# EAGLE design HomeAutomation_relay (EAGLE 8.2.2)
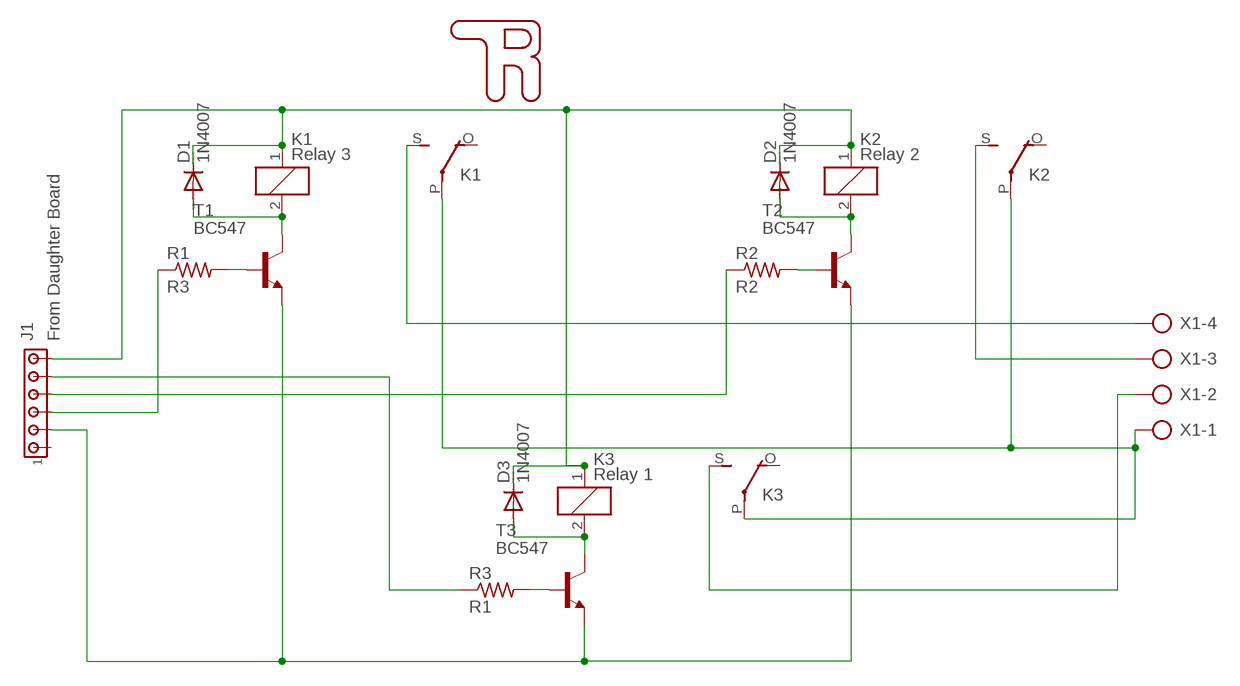
[diagram p0: schematic, sheet 1]

## Parts
D1  1N4007  1N4004  [DO41-10]
D2  1N4007  1N4004  [DO41-10]
D3  1N4007  1N4004  [DO41-10]
J1  From Daughter Board  MTA06-100  [10X06MTA]
K1  Relay 3  G5LE  [G5LE]
K2  Relay 2  G5LE  [G5LE]
K3  Relay 1  G5LE  [G5LE]
R1  R3  R-US_0204/7  [0204/7]
R2  R2  R-US_0204/7  [0204/7]
R3  R1  R-US_0204/7  [0204/7]
T1  BC547  [TO92]
T2  BC547  [TO92]
T3  BC547  [TO92]
U$1  TRLOGO1  [TRLOGO_14]
X1  AK300/4  [AK300/4]

## Nets
N$1: J1.2 T1.1(E) T2.1(E) T3.1(E)
N$2: D2.A K2.2 T2.3(C)
N$3: D1.A K1.2 T1.3(C)
N$6: D3.A K3.2 T3.3(C)
N$7: D1.C D2.C D3.C J1.6 K1.1 K2.1 K3.1
N$8: K1.P(2:P) K2.P(2:P) K3.P(2:P) X1.1
N$10: K3.S(2:S) X1.2
N$11: K1.S(2:S) X1.4
N$12: K2.S(2:S) X1.3
N$13: R1.2 T1.2(B)
N$14: J1.3 R1.1
N$15: J1.4 R2.1
N$16: R2.2 T2.2(B)
N$17: R3.2 T3.2(B)
N$18: J1.5 R3.1
Unconnected: J1.1 K1.O(2:O) K2.O(2:O) K3.O(2:O)

## Library data of the parts
D1-D3 = diode:1N4004: DIODE general purpose rectifier, 1 A
J1 = con-amp:MTA06-100: AMP connector Connection corrected 2014-09-19
K1-K3 = relay:G5LE: RELAY 1 x switch, 10 A/120 V AC, 8 A/30 V DC, Omron; OC_FARNELL: unknown; OC_NEWARK: unknown
R1-R3 = adafruit:R-US_: RESISTOR, American symbol
T1-T3 = transistor-neu-to92:BC547: NPN TRANSISTOR
U$1 = TRLOGO:TRLOGO
X1 = con-ptr500:AK300/4: CONNECTOR

## Board
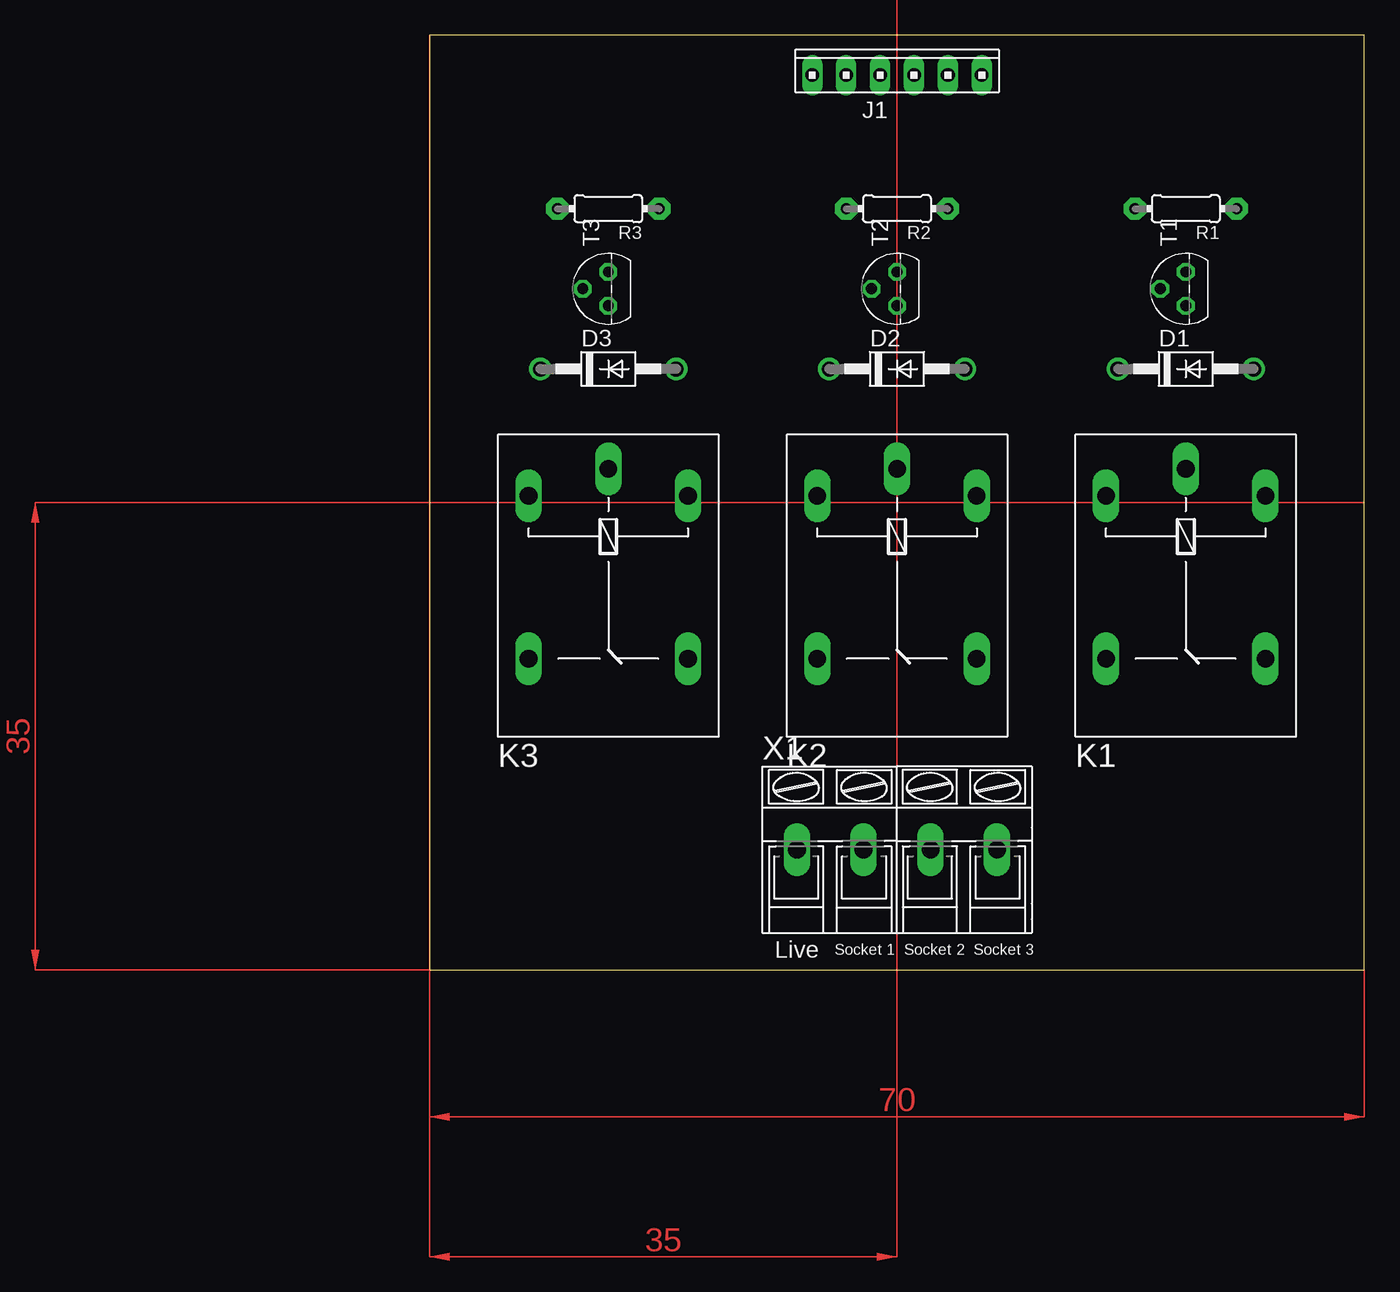
[diagram p1: board, top side]
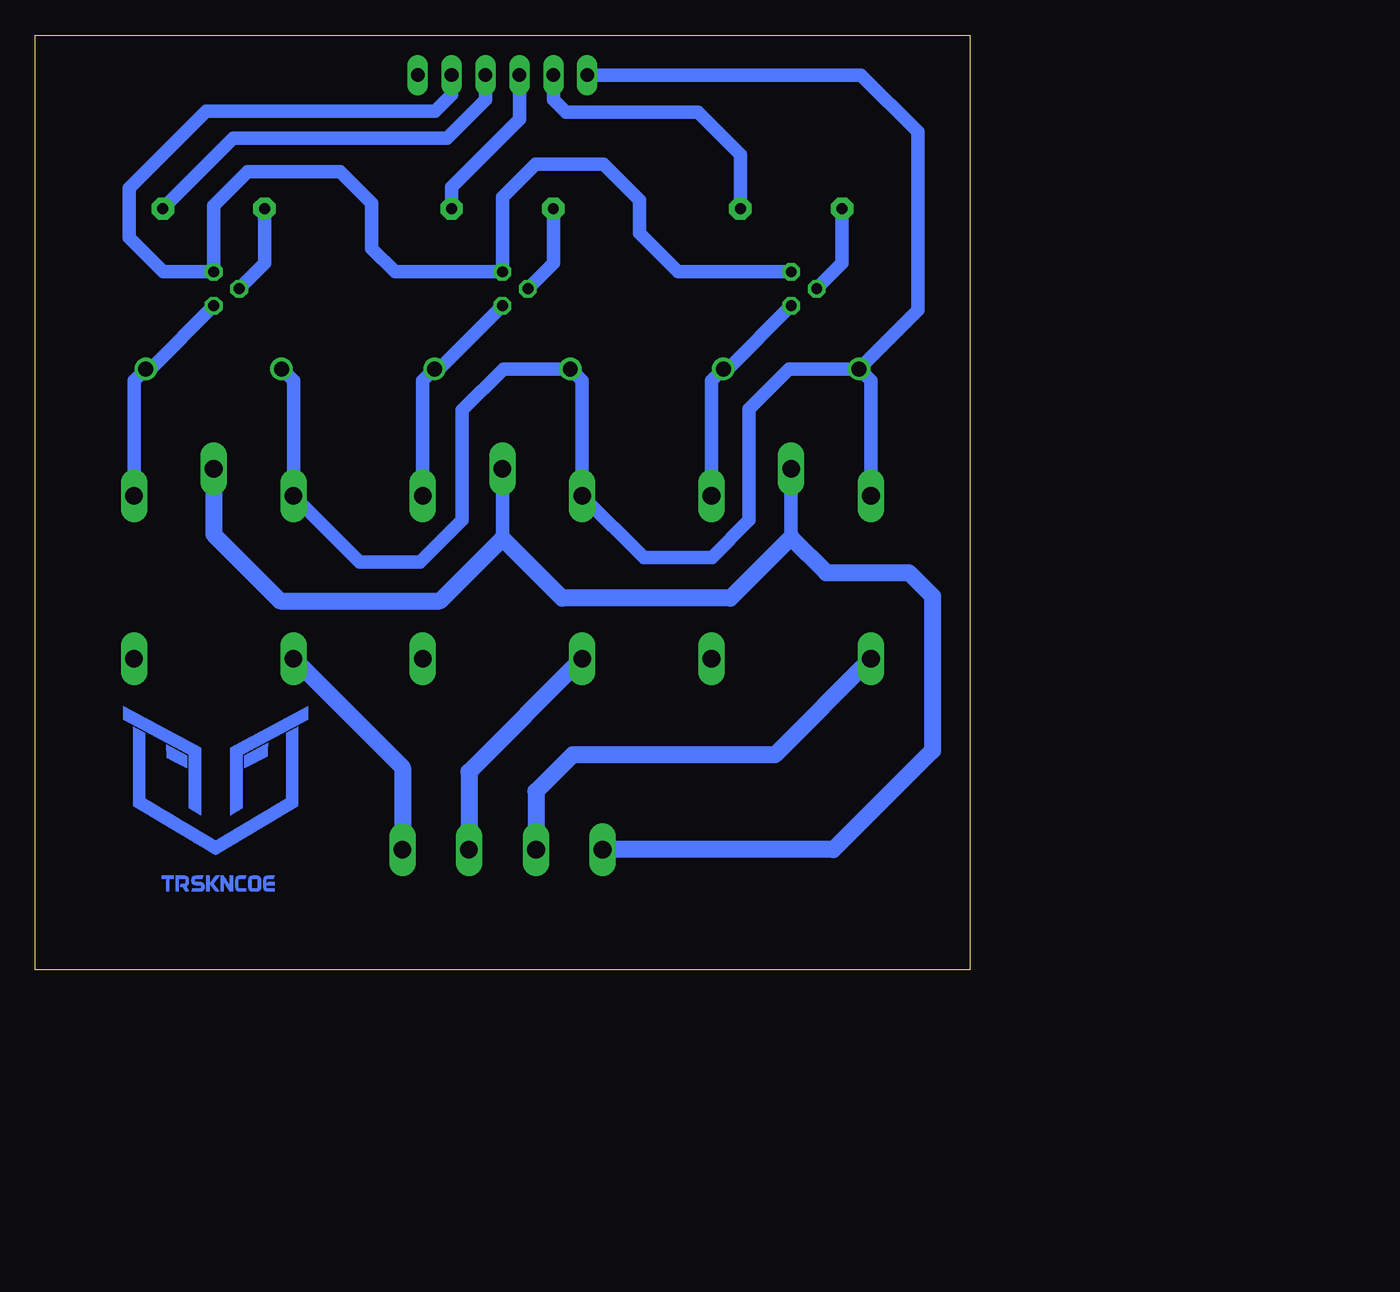
[diagram p2: board, bottom side, seen from below]

Size 70 x 70 mm. Coordinates in mm from the lower left corner, seen from the top.
Outline: 0,0 70,0 70,70 0,70 0,0
Copper layers (1*16): Top 0.035mm / dielectric 1.5mm / Bottom 0.035mm
Design rules "default": minimum track width 6mil, minimum drill 0.35mm, track to track 6mil, track to pad 6mil, pad to pad 6mil, via to via 6mil, smd to smd 6mil, copper to edge 40mil, drill to drill 6mil, minimum pad ring 10mil, minimum via ring 8mil, stop-mask expansion 4mil, vias tented up to drill 0mil, thermal gap 10mil

### Footprints (pad centres in the part's own frame; a part is rotated, then mirrored left to right if it is on the bottom)
DO41-10 = drill 1.118: A 5.08,0; C -5.08,0
10X06MTA = drill 1.016 long: 1 6.35,0; 2 3.81,0; 3 1.27,0; 4 -1.27,0; 5 -3.81,0; 6 -6.35,0
G5LE = drill 1.321 long: 1 -7.493,-5.969; 2 -7.493,5.969; O 4.699,5.969; P -9.525,0; S 4.699,-5.969
0204/7 = drill 0.813 pad 1.676 octagon: 1 -3.81,0; 2 3.81,0
TO92 = drill 0.813 octagon: 1 1.27,0; 2 0,1.905; 3 -1.27,0
AK300/4 = drill 1.321 long: 1 -7.493,0; 2 -2.515,0; 3 2.515,0; 4 7.493,0

### Placement (x,y rotation side)
D1  56.62,45 0 top
D2  35,45 0 top
D3  13.38,45 0 top
J1  35,67 0 top
K1  56.62,28 270 top
K2  35,28 270 top
K3  13.38,28 270 top
R1  56.62,57 180 top
R2  35,57 180 top
R3  13.38,57 180 top
T1  56.62,51 90 top
T2  35,51 90 top
T3  13.38,51 90 top
U$1  56.5,12.8 0 top
X1  35,9 0 top

### Tracks (layer width: path | path; a pad name or v marks a point on that pad's centre or on a via)
N$1
  Bottom 1.016: T3.1 21.84,52.27 24.73,55.15 24.73,57.62 27.43,60.33 32.52,60.33 35,57.85 T2.1 43.05,52.27 44.8,54.02 44.8,57.42 47.15,59.77 54.08,59.77 56.62,57.23 T1.1 60.4,52.27 62.95,54.83 62.95,58.52 57.17,64.3 40.05,64.3 38.81,65.54 J1.2
N$2
  Bottom 1.016: K2.2 40.97,44.11 D2.A 39.73,45 T2.3
N$3
  Bottom 1.016: K1.2 62.59,44.11 D1.A 61.35,45 T1.3
N$6
  Bottom 1.016: K3.2 19.34,44.11 D3.A 18.11,45 T3.3
N$7
  Bottom 1.016: D3.C 7.41,44.11 K3.1 | D1.C 50.66,44.11 K1.1 45.69,30.52 41.17,30.52 38.02,33.67 38.02,41.9 34.92,45 D2.C 29.03,44.11 K2.1 24.41,30.88 19.32,30.88 16.52,33.67 16.52,42 13.53,45 D3.C | J1.6 8.15,67 3.9,62.75 3.9,49.4 D3.C
N$8
  Bottom 1.016: 35,32.3 K2.P | K3.P 13.38,32.38
  Bottom 1.27: K1.P 56.62,32.6 51.65,27.62 39.67,27.62 35,32.3 30.52,27.82 17.93,27.82 13.38,32.38 10.75,29.75 4.58,29.75 2.8,27.98 2.8,16.43 10.22,9 X1.1
N$10
  Bottom 1.27: K3.S 14.61,16.1 29.75,16.1 32.48,13.37 X1.2
N$11
  Bottom 1.27: K1.S 42.49,15.14 X1.4
N$12
  Bottom 1.27: K2.S 37.52,14.82 X1.3
N$13
  Bottom 1.016: R1.2 52.81,52.91 T1.2
N$14
  Bottom 1.016: J1.3 36.27,65.17 39.16,62.27 55.16,62.27 R1.1
N$15
  Bottom 1.016: J1.4 33.73,63.7 38.81,58.62 R2.1
N$16
  Bottom 1.016: R2.2 31.19,52.91 T2.2
N$17
  Bottom 1.016: R3.2 9.56,52.91 T3.2
N$18
  Bottom 1.016: J1.5 31.19,65.17 30.25,64.22 20.35,64.22 17.18,61.06 R3.1
(copper drawn outside any net)
  shapes: Top area x4

### Text on the board
tPlace: Live | Socket 1 Socket 2 Socket 3